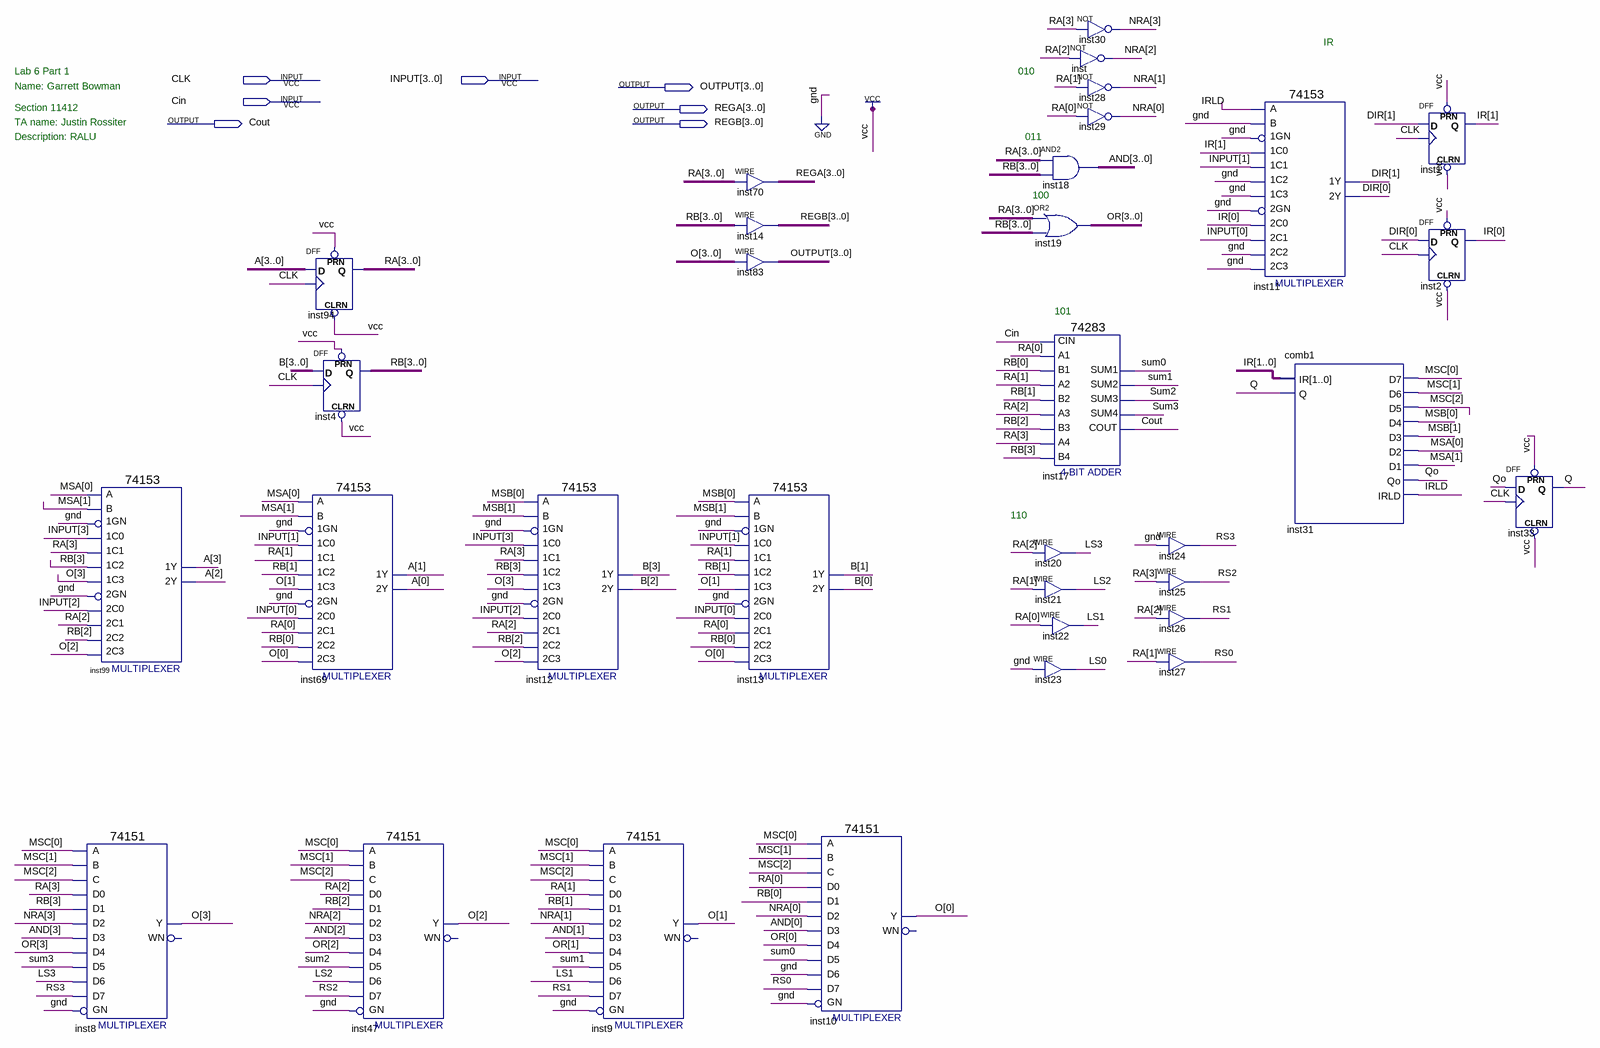
[diagram p0: schematic sheet]
// Quartus schematic LAB6_Part1.bdf as structural Verilog: 33 symbols, 7 pins
module LAB6_Part1 (
  input  CLK,
  input  [3:0] INPUT,
  input  Cin,
  output [3:0] OUTPUT,
  output [3:0] REGA,
  output Cout,
  output [3:0] REGB
);

  wire IRLD, LS0, LS1, LS2, LS3, Q, Qo, RS0, RS1, RS2, RS3, sum0, sum1, Sum2, Sum3;
  wire [1:0] DIR, IR, MSA, MSB;
  wire [2:0] MSC;
  wire [3:0] A, AND, B, NRA, O, OR, RA, RB;

  \74153  inst99 (
    .\1C1 (RA[3]), .\1GN (1'b0), .\1C0 (INPUT[3]), .\2C0 (INPUT[2]), .\2GN (1'b0), .\2C2 (RB[2]),
    .\1C2 (RB[3]), .\1C3 (O[3]), .B(MSA[1]), .A(MSA[0]), .\2C1 (RA[2]), .\2C3 (O[2]), .\1Y (A[3]), .\2Y (A[2]));
  \74151  inst8 (
    .GN(1'b0), .C(MSC[2]), .B(MSC[1]), .A(MSC[0]), .D5(Sum3), .D0(RA[3]), .D1(RB[3]), .D4(OR[3]),
    .D3(AND[3]), .D2(NRA[3]), .D6(LS3), .D7(RS3), .Y(O[3]));  // open: WN
  DFF inst94[3:0] (.CLRN(1'b1), .CLK(CLK), .D(A), .PRN(1'b1), .Q(RA));
  DFF inst4[3:0] (.CLRN(1'b1), .CLK(CLK), .D(B), .PRN(1'b1), .Q(RB));
  \74153  inst69 (
    .\1C1 (RA[1]), .\1GN (1'b0), .\1C0 (INPUT[1]), .\2C0 (INPUT[0]), .\2GN (1'b0), .\2C2 (RB[0]),
    .\1C2 (RB[1]), .\1C3 (O[1]), .B(MSA[1]), .A(MSA[0]), .\2C1 (RA[0]), .\2C3 (O[0]), .\1Y (A[1]), .\2Y (A[0]));
  \74151  inst47 (
    .GN(1'b0), .C(MSC[2]), .B(MSC[1]), .A(MSC[0]), .D5(Sum2), .D0(RA[2]), .D1(RB[2]), .D4(OR[2]),
    .D3(AND[2]), .D2(NRA[2]), .D6(LS2), .D7(RS2), .Y(O[2]));  // open: WN
  \74153  inst12 (
    .\1C1 (RA[3]), .\1GN (1'b0), .\1C0 (INPUT[3]), .\2C0 (INPUT[2]), .\2GN (1'b0), .\2C2 (RB[2]),
    .\1C2 (RB[3]), .\1C3 (O[3]), .B(MSB[1]), .A(MSB[0]), .\2C1 (RA[2]), .\2C3 (O[2]), .\1Y (B[3]), .\2Y (B[2]));
  \74151  inst9 (
    .GN(1'b0), .C(MSC[2]), .B(MSC[1]), .A(MSC[0]), .D5(sum1), .D0(RA[1]), .D1(RB[1]), .D4(OR[1]),
    .D3(AND[1]), .D2(NRA[1]), .D6(LS1), .D7(RS1), .Y(O[1]));  // open: WN
  assign REGA = RA;  // WIRE inst70
  assign REGB = RB;  // WIRE inst14
  assign OUTPUT = O;  // WIRE inst83
  \74153  inst13 (
    .\1C1 (RA[1]), .\1GN (1'b0), .\1C0 (INPUT[1]), .\2C0 (INPUT[0]), .\2GN (1'b0), .\2C2 (RB[0]),
    .\1C2 (RB[1]), .\1C3 (O[1]), .B(MSB[1]), .A(MSB[0]), .\2C1 (RA[0]), .\2C3 (O[0]), .\1Y (B[1]), .\2Y (B[0]));
  \74151  inst10 (
    .GN(1'b0), .C(MSC[2]), .B(MSC[1]), .A(MSC[0]), .D5(sum0), .D0(RA[0]), .D1(RB[0]), .D4(OR[0]),
    .D3(AND[0]), .D2(NRA[0]), .D6(1'b0), .D7(RS0), .Y(O[0]));  // open: WN
  assign AND = RA & RB;  // AND2 inst18, 4 bits wide
  assign OR = RA | RB;  // OR2 inst19, 4 bits wide
  \74283  inst17 (
    .CIN(Cin), .A1(RA[0]), .A2(RA[1]), .B2(RB[1]), .A3(RA[2]), .A4(RA[3]), .B4(RB[3]), .B1(RB[0]),
    .B3(RB[2]), .SUM4(Sum3), .COUT(Cout), .SUM1(sum0), .SUM2(sum1), .SUM3(Sum2));
  assign LS3 = RA[2];  // WIRE inst20
  assign LS2 = RA[1];  // WIRE inst21
  assign LS1 = RA[0];  // WIRE inst22
  assign LS0 = 1'b0;  // WIRE inst23
  not inst30 (NRA[3], RA[3]);
  not inst (NRA[2], RA[2]);
  not inst28 (NRA[1], RA[1]);
  not inst29 (NRA[0], RA[0]);
  assign RS3 = 1'b0;  // WIRE inst24
  assign RS2 = RA[3];  // WIRE inst25
  assign RS1 = RA[2];  // WIRE inst26
  assign RS0 = RA[1];  // WIRE inst27
  \74153  inst11 (
    .\1C1 (INPUT[1]), .\1GN (1'b0), .\1C0 (IR[1]), .\2C0 (IR[0]), .\2GN (1'b0), .\2C2 (1'b0), .\1C2 (1'b0),
    .\1C3 (1'b0), .B(1'b0), .A(IRLD), .\2C1 (INPUT[0]), .\2C3 (1'b0), .\1Y (DIR[1]), .\2Y (DIR[0]));
  comb1 inst31 (
    .IR(IR), .Q(Q), .D7(MSC[0]), .D6(MSC[1]), .D5(MSC[2]), .D4(MSB[0]), .D3(MSB[1]), .D2(MSA[0]),
    .D1(MSA[1]), .Qo(Qo), .IRLD(IRLD));
  DFF inst1 (.CLRN(1'b1), .CLK(CLK), .D(DIR[1]), .PRN(1'b1), .Q(IR[1]));
  DFF inst2 (.CLRN(1'b1), .CLK(CLK), .D(DIR[0]), .PRN(1'b1), .Q(IR[0]));
  DFF inst33 (.CLRN(1'b1), .CLK(CLK), .D(Qo), .PRN(1'b1), .Q(Q));

  // Notes on the sheet:
  //   IR
  //   Lab 6 Part 1
  //   010
  //   Name: Garrett Bowman
  //   Section 11412
  //   TA name: Justin Rossiter
  //   Description: RALU
  //   011
  //   100
  //   101
  //   110
endmodule
